# EAGLE design CHR_ver2 (EAGLE 9.6.2)

## Sheet 1 of 3
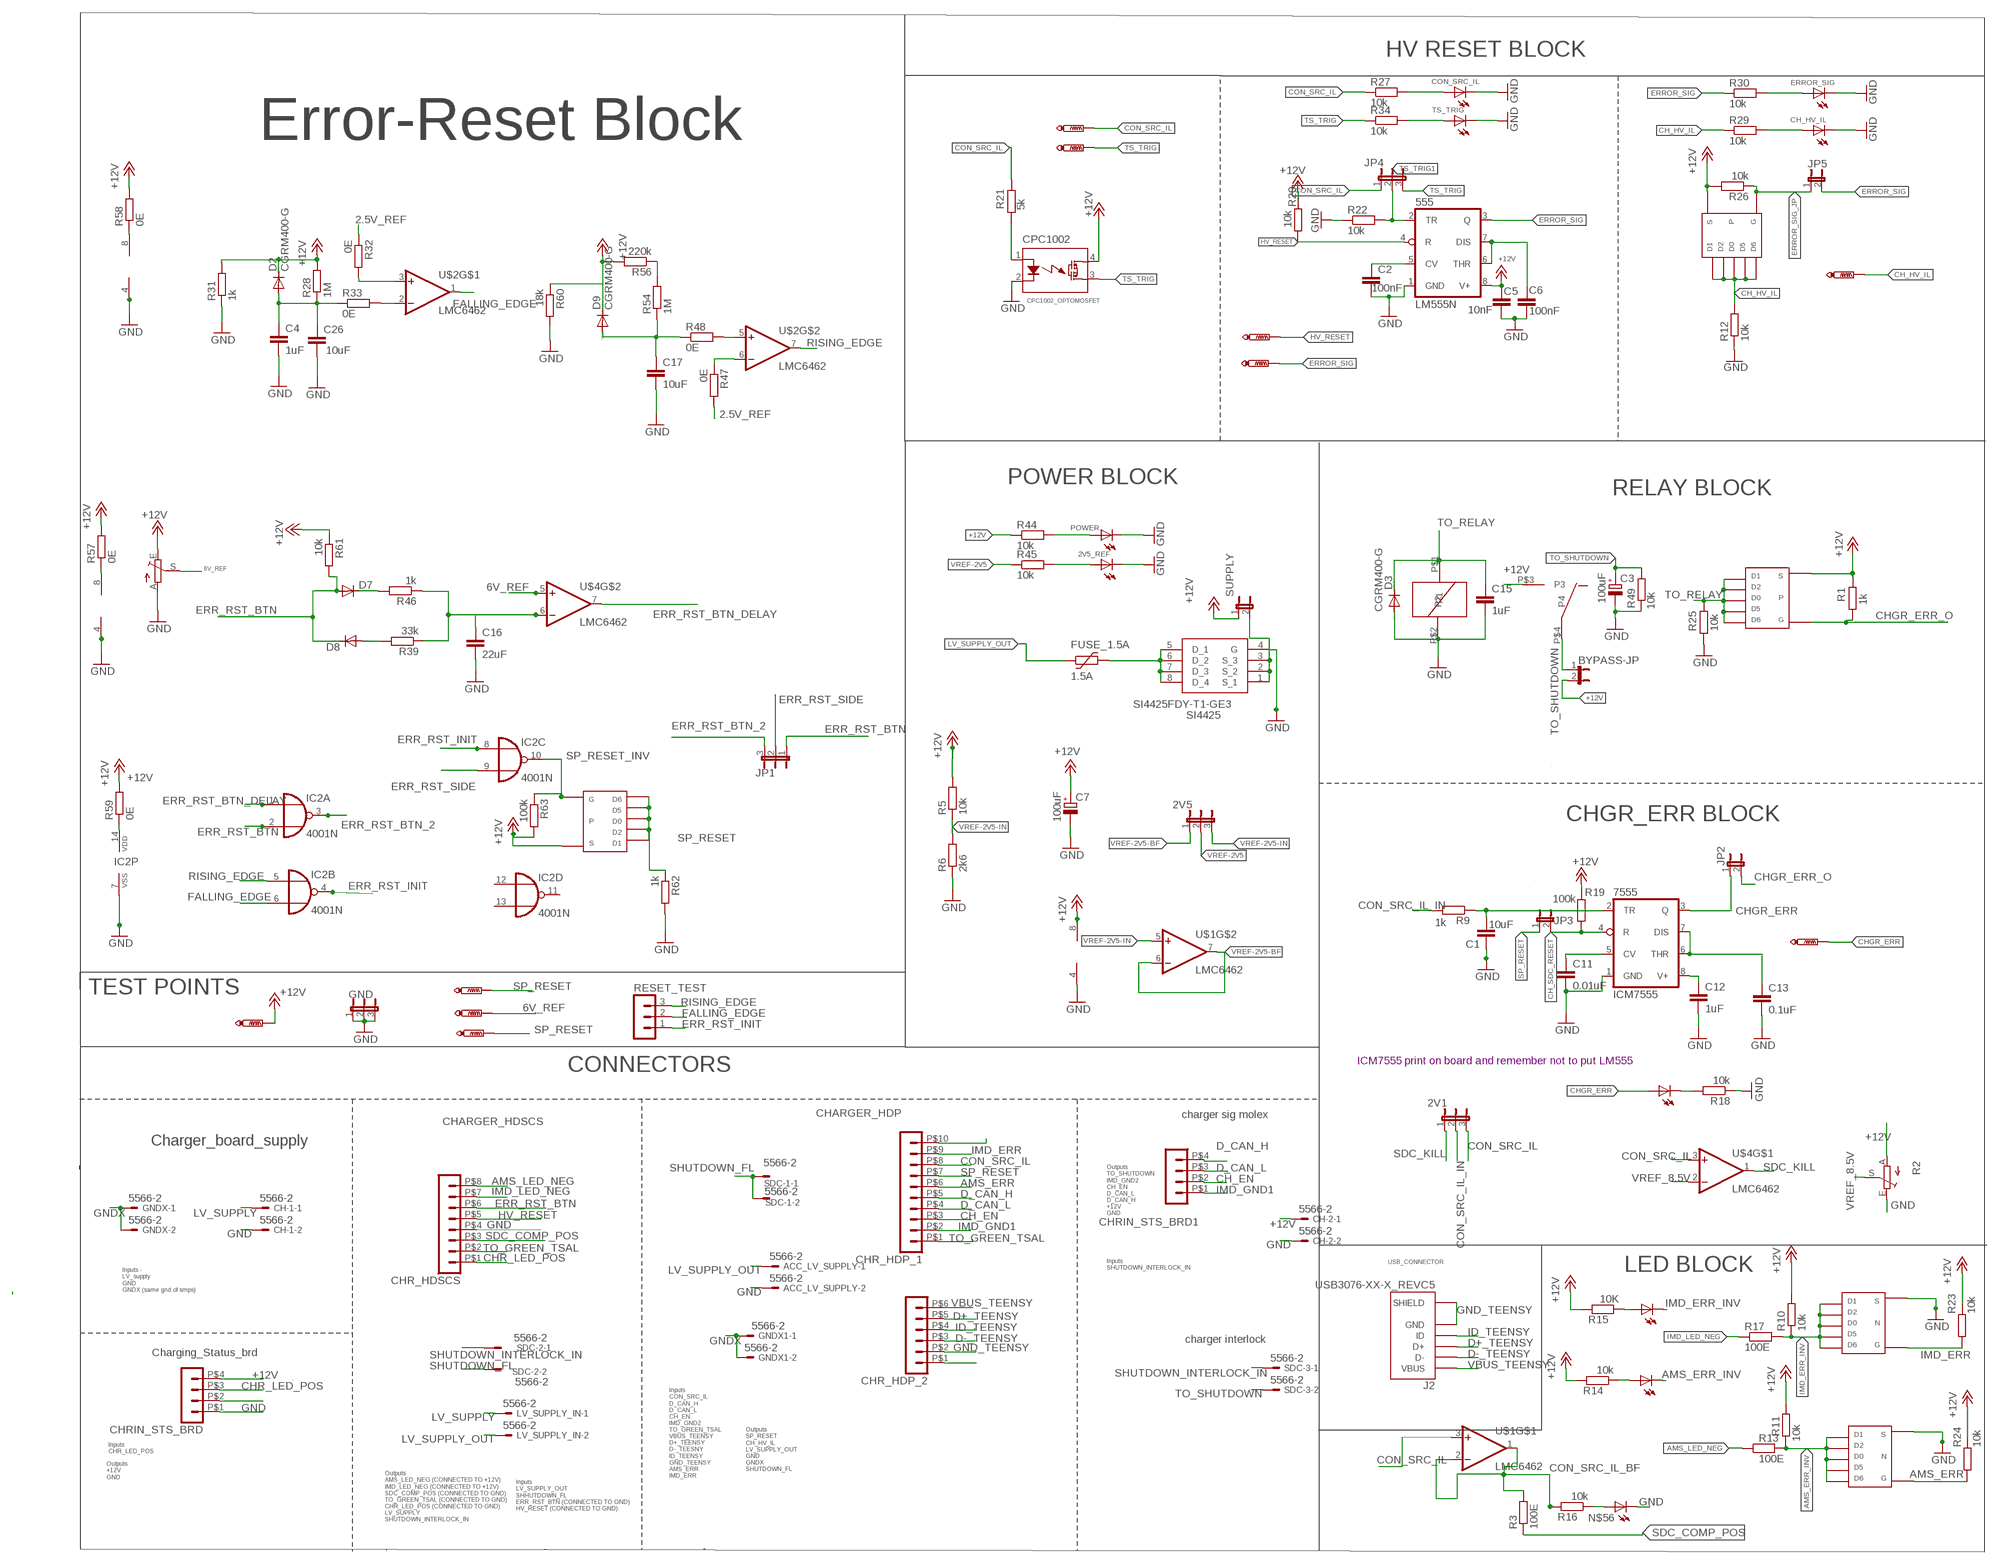
[diagram p0: schematic, sheet 1]

### Parts
2V1  JP2E  [JP2]
2V5  JP2E  [JP2]
2V5_REF  LED-FKIT-1206  [FKIT-LED-1206]
555  LM555N  [DIL08]
7555  ICM7555  LM555N  [DIL08]
+12V  PTR1PAD1-13  [P1-13]
ACC_LV_SUPPLY  5566-2  [5566-2]
AMS  LED-FKIT-1206  [FKIT-LED-1206]
AMS1  LED-FKIT-1206  [FKIT-LED-1206]
BYPASS-JP  JP1E  [JP1]
C1  10uF  C-EUC0805  [C0805]
C2  100nF  C-EUC0805  [C0805]
C3  100uF  CPOL-EUE2.5-6  [E2,5-6]
C4  1uF  C-EUC0805  [C0805]
C5  10nF  C-EUC0805  [C0805]
C6  100nF  C-EUC0805  [C0805]
C7  100uF  CPOL-EUE2.5-6  [E2,5-6]
C11  0.01uF  C-EUC0805  [C0805]
C12  1uF  C-EUC0805  [C0805]
C13  0.1uF  C-EUC0805  [C0805]
C15  1uF  C-EUC0805  [C0805]
C16  22uF  C-EUC0805  [C0805]
C17  10uF  C-EUC0805  [C0805]
C26  10uF  C-EUC0805  [C0805]
CH-1  5566-2  [5566-2]
CH-2  5566-2  [5566-2]
CH-HV-IL  PTR1PAD1-13  [P1-13]
CH_HV_IL  LED-FKIT-1206  [FKIT-LED-1206]
CHGR-ERR  PTR1PAD1-13  [P1-13]
CHGR_ERR  LED-FKIT-1206  [FKIT-LED-1206]
CHR_HDP_1  HEADER_POS10_44914-1001  [44914-1001]
CHR_HDP_2  HEADER_POS6_44914-0601  [44914-0601]
CHR_HDSCS  HEADER_POS8_44914-0801  [44914-0801]
CHRIN_STS_BRD  HEADER_POS4_44914-0401  [44914-0401]
CHRIN_STS_BRD1  HEADER_POS4_44914-0401  [44914-0401]
CON-SRC-IL  PTR1PAD1-13  [P1-13]
CON_SRC_IL  LED-FKIT-1206  [FKIT-LED-1206]
CPC1002  CPC1002_OPTOMOSFET  [SOP04]
D2  CGRM400-G  [SOD-123_MINI-SMA]
D3  CGRM400-G  [SOD-123_MINI-SMA]
D7  DIODE-DO214AC  [DO214AC]
D8  DIODE-DO214AC  [DO214AC]
D9  CGRM400-G  [SOD-123_MINI-SMA]
ERROR-SIG  PTR1PAD1-13  [P1-13]
ERROR_SIG  LED-FKIT-1206  [FKIT-LED-1206]
FUSE_1.5A  1.5A  1206L  [1206L]
GND  JP2E  [JP2]
GNDX  5566-2  [5566-2]
GNDX1  5566-2  [5566-2]
HV-RESET  PTR1PAD1-13  [P1-13]
IC2  4001N  [DIL14]
IMD  LED-FKIT-1206  [FKIT-LED-1206]
J2  USB3076-XX-X_REVC5  [GCT_USB3076-XX-X_REVC5]
JP1  JP2E  [JP2]
JP2  JP1E  [JP1]
JP3  JP1E  [JP1]
JP4  JP2E  [JP2]
JP5  JP1E  [JP1]
LV_SUPPLY_IN  5566-2  [5566-2]
POWER  LED-FKIT-1206  [FKIT-LED-1206]
R1  1k  R-EU_R0805  [R0805]
R2  TRIM_EU-S63S  [S63S]
R3  100E  R-EU_M0805  [M0805]
R5  10k  R-EU_R0805  [R0805]
R6  2k6  R-EU_R0805  [R0805]
R9  1k  R-EU_R0805  [R0805]
R10  10k  R-EU_R0805  [R0805]
R11  10k  R-EU_R0805  [R0805]
R12  10k  R-EU_R0805  [R0805]
R13  100E  R-EU_M0805  [M0805]
R14  10k  R-EU_M0805  [M0805]
R15  10K  R-EU_M0805  [M0805]
R16  10k  R-EU_M0805  [M0805]
R17  100E  R-EU_M0805  [M0805]
R18  10k  R-EU_R0805  [R0805]
R19  100k  R-EU_R0805  [R0805]
R20  10k  R-EU_R0805  [R0805]
R21  5k  R-EU_R0805  [R0805]
R22  10k  R-EU_R0805  [R0805]
R23  10k  R-EU_R0805  [R0805]
R24  10k  R-EU_R0805  [R0805]
R25  10k  R-EU_R0805  [R0805]
R26  10k  R-EU_R0805  [R0805]
R27  10k  R-EU_R0805  [R0805]
R28  1M  R-EU_R0805  [R0805]
R29  10k  R-EU_R0805  [R0805]
R30  10k  R-EU_R0805  [R0805]
R31  1k  R-EU_R0805  [R0805]
R32  0E  R-EU_R0805  [R0805]
R33  0E  R-EU_R0805  [R0805]
R34  10k  R-EU_R0805  [R0805]
R39  33k  R-EU_R0805  [R0805]
R44  10k  R-EU_R0805  [R0805]
R45  10k  R-EU_R0805  [R0805]
R46  1k  R-EU_R0805  [R0805]
R47  0E  R-EU_R0805  [R0805]
R48  0E  R-EU_R0805  [R0805]
R49  10k  R-EU_R0805  [R0805]
R54  1M  R-EU_R0805  [R0805]
R56  220k  R-EU_R0805  [R0805]
R57  0E  R-EU_R0805  [R0805]
R58  0E  R-EU_R0805  [R0805]
R59  0E  R-EU_R0805  [R0805]
R60  18k  R-EU_R0805  [R0805]
R61  10k  R-EU_R0805  [R0805]
R62  1k  R-EU_R0805  [R0805]
R63  100k  R-EU_R0805  [R0805]
REF_POT1  10k  TRIM_EU-S63S  [S63S]
RESET_TEST  MA03-1  [MA03-1]
SDC-1  5566-2  [5566-2]
SDC-2  5566-2  [5566-2]
SDC-3  5566-2  [5566-2]
SI4425  SI4425FDY-T1-GE3  [SOIC127P600X175-8N]
SP_RESET  PTR1PAD1-13  [P1-13]
SP_RESET1  PTR1PAD1-13  [P1-13]
SP_RESET2  PTR1PAD1-13  [P1-13]
SUPPLY  JP1E  [JP1]
TS-TRIG  PTR1PAD1-13  [P1-13]
TS_TRIG  LED-FKIT-1206  [FKIT-LED-1206]
U$1  LMC6462  [S08]
U$2  LMC6462  [S08]
U$3  TSOP-6_PMOS  [TSOP-6_PMOS]
U$4  LMC6462  [S08]
U$5  TSOP-6_NMOS  [TSOP-6_NMOS]
U$7  TSOP-6_NMOS  [TSOP-6_NMOS]
U$8  TSOP-6_PMOS  [TSOP-6_PMOS]
U$9  G6DN_RELAY  [G6DN_RELAY]
U$11  TSOP-6_PMOS  [TSOP-6_PMOS]

### Nets
2.5V_REF: R32.1 R47.2
6V_REF: REF_POT1.S SP_RESET1.TP U$4.5(+IN)
+12V: 555.8(V+) 7555.8(V+) +12V.TP BYPASS-JP.2 C5.1 C7.+ C12.1 CH-2.1 CHRIN_STS_BRD.P$4 CPC1002.4 D2.C D9.C R1.2 R2.A R5.2 R10.2 R11.2 R14.2 R15.2 R19.1 R20.2 R23.2 R24.2 R26.2 R28.2 R31.2 R44.1 R56.2 R57.2 R58.2 R59.2 R60.1 R61.1 R63.2 REF_POT1.E SUPPLY.1 U$1.8(V+) U$3.S U$8.S U$9.P$3(P3) U$11.S
AMS_ERR: CHR_HDP_1.P$6 R24.1 U$5.G
AMS_ERR_INV: AMS.C R11.1 R13.2 U$5.1 U$5.2 U$5.5 U$5.6 U$5.D(D0)
AMS_LED_NEG: CHR_HDSCS.P$8 R13.1
CH_EN: CHR_HDP_1.P$3 CHRIN_STS_BRD1.P$2
CH_HV_IL: CH-HV-IL.TP CHR_HDP_1.P$10 R12.2 R29.1 U$8.1 U$8.2 U$8.5 U$8.6 U$8.D(D0)
CH_SDC_RESET: 7555.4(R) JP3.2 R19.2
CHGR_ERR: 7555.3(Q) CHGR-ERR.TP CHGR_ERR.A JP2.1
CHGR_ERR_O: JP2.2 R1.1 U$3.G
CHR_LED_POS: CHR_HDSCS.P$1 CHRIN_STS_BRD.P$3
CON_SRC_IL: 2V1.3 CHR_HDP_1.P$8 CON-SRC-IL.TP JP4.1 R21.2 R27.1 U$1.3(+IN) U$4.3(+IN)
CON_SRC_IL_BF: R3.2 R16.2 U$1.1(OUT) U$1.2(-IN)
CON_SRC_IL_IN: 2V1.2 R9.2
D+_TEENSY: CHR_HDP_2.P$5 J2.3(D+)
D-_TEENSY: CHR_HDP_2.P$3 J2.2(D-)
D_CAN_H: CHR_HDP_1.P$5 CHRIN_STS_BRD1.P$4
D_CAN_L: CHR_HDP_1.P$4 CHRIN_STS_BRD1.P$3
ERR_RST_BTN: CHR_HDSCS.P$6 D7.A D8.C IC2.2(A:I1) JP1.1 R61.2
ERR_RST_BTN_2: IC2.3(A:O) JP1.3
ERR_RST_BTN_DELAY: IC2.1(A:I0) U$4.7(OUT)
ERR_RST_INIT: IC2.4(B:O) IC2.8(C:I0) RESET_TEST.1
ERR_RST_SIDE: IC2.9(C:I1) JP1.2
ERROR_SIG: 555.3(Q) ERROR-SIG.TP JP5.2 R30.1
ERROR_SIG_JP: JP5.1 R26.1 U$8.G
FALLING_EDGE: IC2.6(B:I1) RESET_TEST.2 U$2.1(OUT)
GND: 2V5_REF.C 555.1(GND) 7555.1(GND) ACC_LV_SUPPLY.2 AMS1.C C1.1 C2.2 C3.- C4.2 C5.2 C6.2 C7.- C11.2 C12.2 C13.2 C15.2 C16.2 C17.2 C26.2 CH-1.2 CH-2.2 CH_HV_IL.C CHR_HDSCS.P$4 CHRIN_STS_BRD.P$1 CON_SRC_IL.C CPC1002.2 D3.A ERROR_SIG.C GND.1 GND.2 GND.3 IC2.7(P:VSS) POWER.C R2.E R6.1 R12.1 R18.1 R22.1 R25.1 R31.1 R49.1 R60.2 R62.2 REF_POT1.A SI4425.4(G) TS_TRIG.C U$1.4(V-) U$2.4(V-) U$4.4(V-) U$5.S U$7.S U$9.P$2(P2)
GND_TEENSY: CHR_HDP_2.P$2 J2.5(GND) J2.6(SHIELD) J2.7(SHIELD) J2.8(SHIELD) J2.9(SHIELD) J2.10(SHIELD) J2.11(SHIELD)
GNDX: GNDX1.1 GNDX1.2 GNDX.1 GNDX.2
HV_RESET: 555.4(R) CHR_HDSCS.P$5 HV-RESET.TP R20.1
ID_TEENSY: CHR_HDP_2.P$4 J2.4(ID)
IMD_ERR: CHR_HDP_1.P$9 R23.1 U$7.G
IMD_ERR_INV: IMD.C R10.1 R17.2 U$7.1 U$7.2 U$7.5 U$7.6 U$7.D(D0)
IMD_GND1: CHR_HDP_1.P$2 CHRIN_STS_BRD1.P$1
IMD_LED_NEG: CHR_HDSCS.P$7 R17.1
LV_SUPPLY: CH-1.1 LV_SUPPLY_IN.1
LV_SUPPLY_OUT: ACC_LV_SUPPLY.1 FUSE_1.5A.P$1 LV_SUPPLY_IN.2
N$1: 7555.2(TR) C1.2 R9.1
N$3: 555.5(CV) C2.1
N$4: CHGR_ERR.C R18.2
N$7: 555.6(THR) 555.7(DIS) C6.1
N$9: CPC1002.1 R21.1
N$10: CON_SRC_IL.A R27.2
N$11: CH_HV_IL.A R29.2
N$13: ERROR_SIG.A R30.2
N$14: R34.2 TS_TRIG.A
N$16: 7555.5(CV) C11.1
N$18: 7555.6(THR) 7555.7(DIS) C13.1
N$21: SI4425.1(S_1) SI4425.2(S_2) SI4425.3(S_3) SUPPLY.2
N$23: FUSE_1.5A.P$2 SI4425.5(D_1) SI4425.6(D_2) SI4425.7(D_3) SI4425.8(D_4)
N$24: POWER.A R44.2
N$26: 2V5_REF.A R45.2
N$33: CHR_HDP_2.P$1
N$35: AMS.A R14.1
N$37: IMD.A R15.1
N$38: C4.1 C26.1 D2.A R28.1 R33.1
N$39: CHRIN_STS_BRD.P$2
N$40: R32.2 U$2.3(+IN)
N$41: R33.2 U$2.2(-IN)
N$42: D8.A R39.2
N$43: D7.C R46.2
N$44: C16.1 R39.1 R46.1 U$4.6(-IN)
N$45: R47.1 U$2.6(-IN)
N$46: C17.1 D9.A R48.1 R54.1
N$47: R48.2 U$2.5(+IN)
N$48: R54.2 R56.1
N$49: R58.1 U$2.8(V+)
N$50: R57.1 U$4.8(V+)
N$51: IC2.14(P:VDD) R59.1
N$56: AMS1.A R16.1
RISING_EDGE: IC2.5(B:I0) RESET_TEST.3 U$2.7(OUT)
SDC_COMP_POS: CHR_HDSCS.P$3 R3.1
SDC_KILL: 2V1.1 U$4.1(OUT)
SHUTDOWN_FL: SDC-1.1 SDC-1.2 SDC-2.2
SHUTDOWN_INTERLOCK_IN: SDC-2.1 SDC-3.1
SP_RESET: CHR_HDP_1.P$7 JP3.1 R62.1 SP_RESET2.TP SP_RESET.TP U$11.1 U$11.2 U$11.5 U$11.6 U$11.D(D0)
SP_RESET_INV: IC2.10(C:O) R63.1 U$11.G
TO_GREEN_TSAL: CHR_HDP_1.P$1 CHR_HDSCS.P$2
TO_RELAY: C15.1 D3.C R25.2 U$3.1 U$3.2 U$3.5 U$3.6 U$3.D(D0) U$9.P$1(P1)
TO_SHUTDOWN: BYPASS-JP.1 C3.+ R49.2 SDC-3.2 U$9.P$4(P4)
TS_TRIG: CPC1002.3 JP4.3 R34.1 TS-TRIG.TP
TS_TRIG1: 555.2(TR) JP4.2 R22.2
VBUS_TEENSY: CHR_HDP_2.P$6 J2.1(VBUS)
VREF-2V5: 2V5.2 R45.1
VREF-2V5-BF: 2V5.1 U$1.6(-IN) U$1.7(OUT)
VREF-2V5-IN: 2V5.3 R5.1 R6.2 U$1.5(+IN)
VREF_8.5V: R2.S U$4.2(-IN)
Unconnected: IC2.11(D:O) IC2.12(D:I0) IC2.13(D:I1)

### Notes on the sheet
- HV RESET BLOCK
- Error-Reset Block
- POWER BLOCK
- RELAY BLOCK
- CHGR_ERR BLOCK
- TEST POINTS
- ICM7555 print on board and remember not to put LM555
- CONNECTORS
- CHARGER_HDP | charger sig molex
- CHARGER_HDSCS
- Charger_board_supply
- Outputs
  TO_SHUTDOWN
  IMD_GND2
  CH_EN
  D_CAN_L
  D_CAN_H
  +12V
  GND
- USB_CONNECTOR
- Inputs
  SHUTDOWN_INTERLOCK_IN
- LED BLOCK
- Inputs -
  LV_supply
  GND
  GNDX (same gnd of smps)
- charger interlock
- Charging_Status_brd
- Inputs
  CHR_LED_POS
- Inputs
  CON_SRC_IL
  D_CAN_H
  D_CAN_L
  CH_EN
  IMD_GND2
  TO_GREEN_TSAL
  VBUS_TEENSY
  D+_TEENSY
  D-_TEESNY
  ID_TEENSY
  GND_TEENSY
  AMS_ERR
  IMD_ERR
- Outputs
  SP_RESET
  CH_HV_IL
  LV_SUPPLY_OUT
  GND
  GNDX
  SHUTDOWN_FL
- Outputs
  +12V
  GND
- Inputs
  LV_SUPPLY_OUT
  SHHUTDOWN_FL
  ERR_RST_BTN (CONNECTED TO GND)
  HV_RESET (CONNECTED TO GND)
- Outputs
  AMS_LED_NEG (CONNECTED TO +12V)
  IMD_LED_NEG (CONNECTED TO +12V)
  SDC_COMP_POS (CONNECTED TO GND)
  TO_GREEN_TSAL (CONNECTED TO GND)
  CHR_LED_POS (CONNECTED TO GND)
  LV_SUPPLY
  SHUTDOWN_INTERLOCK_IN

## Sheet 2 of 3

## Sheet 3 of 3

## Library data of the parts
2V1 2V5 GND JP1 JP4 = jumper:JP2E: JUMPER
2V5_REF AMS AMS1 CH_HV_IL CHGR_ERR CON_SRC_IL ERROR_SIG IMD POWER TS_TRIG = IIT_BOMBAY_Racing:LED: LEDs Standard schematic elements and footprints for 5mm, 3mm, 1206, and 0603 sized LEDs. 5mm - Spark Fun Electronics SKU : COM-00529 (and others)
555 7555 = linear:*555: TIMER
+12V CH-HV-IL CHGR-ERR CON-SRC-IL ERROR-SIG HV-RESET SP_RESET SP_RESET1 SP_RESET2 TS-TRIG = testpad:PTR1: TEST PIN
ACC_LV_SUPPLY CH-1 CH-2 GNDX GNDX1 LV_SUPPLY_IN SDC-1-SDC-3 = con-molex:5566-2: Mini FIT connector 2 pol Source: http://www.molex.com; MF: MOLEX; OC_FARNELL: 1822072; OC_NEWARK: unknown
BYPASS-JP JP2 JP3 JP5 SUPPLY = jumper:JP1E: JUMPER
C1 C2 C4-C6 C11-C13 C15-C17 C26 = IIT_BOMBAY_Racing:C-EU: CAPACITOR, European symbol
C3 C7 = IIT_BOMBAY_Racing:CPOL-EU: POLARIZED CAPACITOR, European symbol
CHR_HDP_1 = IIT_BOMBAY_Racing:HEADER_POS10_?: Molex - Micro-Fit 3.0 Series connector, 3.00mm (0.118") pitch header, 10 positions.
CHR_HDP_2 = IIT_BOMBAY_Racing:HEADER_POS6_?: Molex - Micro-Fit 3.0 Series connector, 3.00mm (0.118") pitch header, 6 positions.
CHR_HDSCS = IIT_BOMBAY_Racing:HEADER_POS8_?: Molex - Micro-Fit 3.0 Series connector, 3.00mm (0.118") pitch header, 8 positions.
CHRIN_STS_BRD CHRIN_STS_BRD1 = IIT_BOMBAY_Racing:HEADER_POS4_?: Molex - Micro-Fit 3.0 Series connector, 3.00mm (0.118") pitch header, 4 positions.
CPC1002 = IIT_BOMBAY_Racing:CPC1002_OPTOMOSFET: optomosfet for the precharge brd(hv indicator)
D2 D3 D9 = IIT_BOMBAY_Racing:CGRM400*-G: Molded plasitc,JEDEC SOD-123/Mini SMA Source: Comchip CGRM4001-G.pdf
D7 D8 = IIT_BOMBAY_Racing2:DIODE-: DIODE
FUSE_1.5A = fuse_1206L:1206L; MFR: Littelfuse; MFR_ID: 1206L175SLYR; PRODUCT_ID: 576-1206L175SLYR
IC2 = 40xx:4001: Quad 2-input NOR
J2 = USB3076-XX-X_REVC5:USB3076-XX-X_REVC5: Check availability <https://pricing.snapeda.com/parts/USB3076-30-A/Global%20Connector%20Technology/view-part?ref=eda>; AVAILABILITY: Not in stock; CHECK_PRICES: https://www.snapeda.com/parts/USB3076-30-A/Global+Connector+Technology/view-part/?ref=eda; DESCRIPTION: USB - micro B USB 2.0 Receptacle Connector 5 Position Surface Mount, Right Angle; Through Hole, 2.35mm profile, 5 Pins, Horizontal, Bottom mount; MF: Global Connector Technology; MP: USB3076-30-A; PACKAGE: None; PRICE: None; SNAPEDA_LINK: https://www.snapeda.com/parts/USB3076-30-A/Global+Connector+Technology/view-part/?ref=snap
R1 R5 R6 R9-R12 R18-R34 R39 R44-R49 R54 R56-R63 = IIT_BOMBAY_Racing:R-EU_: RESISTOR, European symbol
R2 REF_POT1 = IIT_BOMBAY_Racing:TRIM_EU-: POTENTIOMETER
R3 R13-R17 = rcl:R-EU_: RESISTOR, European symbol; SPICEPREFIX: R
RESET_TEST = con-lstb:MA03-1: PIN HEADER; OC_FARNELL: unknown; OC_NEWARK: unknown
SI4425 = SamacSys_Parts:SI4425FDY-T1-GE3: MOSFET P-CHANNEL 30-V (D-S) MOSFET Source: Datasheet <https://www.vishay.com/docs/77095/si4425fdy.pdf>; DESCRIPTION: MOSFET P-CHANNEL 30-V (D-S) MOSFET; HEIGHT: 1.75mm; MANUFACTURER_NAME: Vishay; MANUFACTURER_PART_NUMBER: SI4425FDY-T1-GE3; MOUSER_PART_NUMBER: 78-SI4425FDY-T1-GE3; MOUSER_PRICE-STOCK: https://www.mouser.co.uk/ProductDetail/Vishay-Siliconix/SI4425FDY-T1-GE3?qs=%252B6g0mu59x7IUQKSn86z1oQ%3D%3D
U$1 U$2 U$4 = IIT_BOMBAY_Racing:LMC6462
U$3 U$11 = TSOP-6_MOS:TSOP-6_PMOS
U$5 U$7 = TSOP-6_MOS:TSOP-6_NMOS
U$8 = ACU-MOSFET-updated:TSOP-6_PMOS
U$9 = G6DN_Omron:G6DN_RELAY

## Board
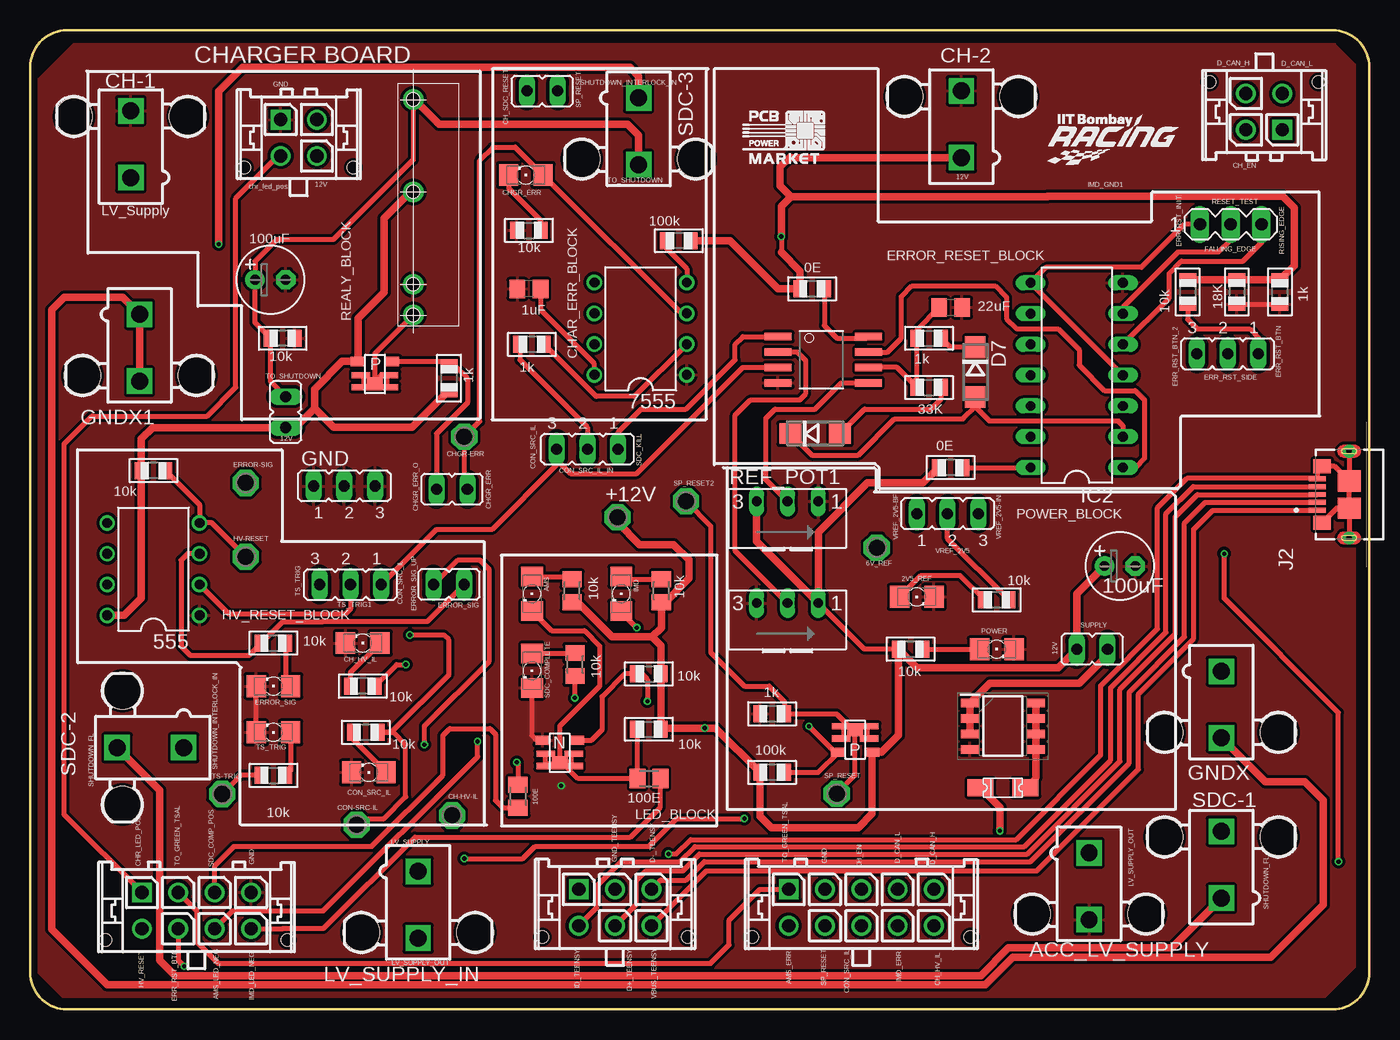
[diagram p1: board, top side]
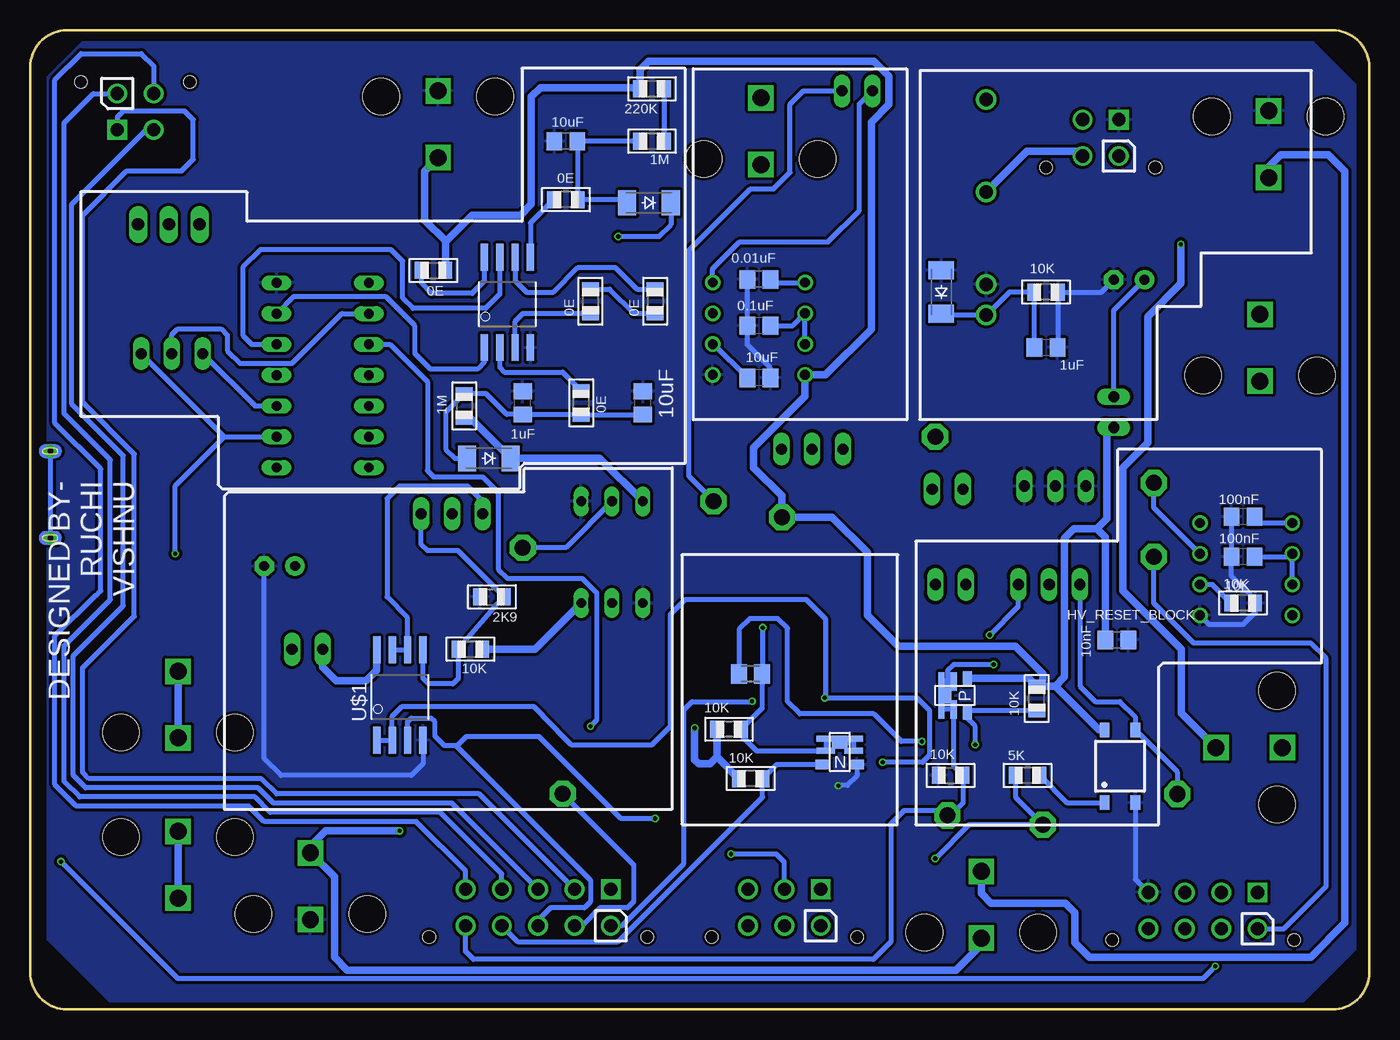
[diagram p2: board, bottom side, seen from below]

Size 110.49 x 80.77 mm. Coordinates in mm from the lower left corner, seen from the top.
Outline: 0,3.05 0,77.72 arc-90 3.05,80.77 107.44,80.77 arc-90 110.49,77.72 110.49,3.05 arc-90 107.44,0 3.05,0 arc-90 0,3.05
Copper layers (1*16): Top 0.035mm / dielectric 1.5mm / Bottom 0.035mm
Design rules "PCB_Power": minimum track width 5mil, minimum drill 10mil, track to track 5mil, track to pad 5mil, pad to pad 5mil, via to via 5mil, smd to smd 5mil, copper to edge 10mil, drill to drill 6mil, minimum pad ring 5mil, minimum via ring 5mil, stop-mask expansion 3mil, vias tented up to drill 0mil, thermal gap 10mil

### Footprints (pad centres in the part's own frame; a part is rotated, then mirrored left to right if it is on the bottom)
JP2 = drill 0.914 long: 1 -2.54,0; 2 0,0; 3 2.54,0
FKIT-LED-1206 = smd 1.6 x 1.803: A -1.422,0; C 1.422,0
DIL08 = drill 0.813 pad 1.27: 1 -3.81,-3.81; 2 -1.27,-3.81; 3 1.27,-3.81; 4 3.81,-3.81; 5 3.81,3.81; 6 1.27,3.81; 7 -1.27,3.81; 8 -3.81,3.81
P1-13 = drill 1.321 pad 2.159 octagon: TP 0,0
5566-2 = drill 1.4 square: 1 0,-2.75; 2 0,2.75 | hole 3: 4.7,2.29; -4.7,2.29
JP1 = drill 0.914 long: 1 0,-1.27; 2 0,1.27
C0805 = smd 1.3 x 1.5: 1 -0.95,0; 2 0.95,0
E2,5-6 = drill 0.813 pad 1.6: + -1.27,0 | drill 0.813 pad 1.6 octagon: - 1.27,0
44914-1001 = drill 1.09 square: P$1 6,0 | drill 1.09: P$2 3,0; P$3 0,0; P$4 -3,0; P$5 -6,0; P$6 6,3; P$7 3,3; P$8 0,3; P$9 -3,3; P$10 -6,3 | hole 1.02: 9,3.94; -9,3.94
44914-0601 = drill 1.09 square: P$1 3,0 | drill 1.09: P$2 0,0; P$3 -3,0; P$4 3,3; P$5 0,3; P$6 -3,3 | hole 1.02: 6,3.94; -6,3.94
44914-0801 = drill 1.09 square: P$1 4.5,0 | drill 1.09: P$2 1.5,0; P$3 -1.5,0; P$4 -4.5,0; P$5 4.5,3; P$6 1.5,3; P$7 -1.5,3; P$8 -4.5,3 | hole 1.02: 7.5,3.94; -7.5,3.94
44914-0401 = drill 1.09 square: P$1 1.5,0 | drill 1.09: P$2 -1.5,0; P$3 1.5,3; P$4 -1.5,3 | hole 1.02: 4.5,3.94; -4.5,3.94
SOP04 = smd 0.8 x 1.2: 1 -1.27,-3; 2 1.27,-3; 3 1.27,3; 4 -1.27,3
SOD-123_MINI-SMA = smd 1.5 x 2.1: A 1.8,0; C -1.8,0
DO214AC = smd 1.8 x 1.7: A 2.05,0; C -2.05,0
1206L = smd 2.16 x 1.4: P$1 -1.85,0; P$2 1.85,0
DIL14 = drill 0.813 long: 1 -7.62,-3.81; 2 -5.08,-3.81; 3 -2.54,-3.81; 4 0,-3.81; 5 2.54,-3.81; 6 5.08,-3.81; 7 7.62,-3.81; 8 7.62,3.81; 9 5.08,3.81; 10 2.54,3.81; 11 0,3.81; 12 -2.54,3.81; 13 -5.08,3.81; 14 -7.62,3.81
GCT_USB3076-XX-X_REVC5 = smd 0.4 x 1.4: 1 -1.3,2.65; 2 -0.65,2.65; 3 0,2.65; 4 0.65,2.65; 5 1.3,2.65 | drill 0.45 pad 1.05: 6 -3.575,0; 7 3.575,0 | smd 1.15 x 1.45: 8 -2.32,2.23; 9 2.32,2.23 | smd 1.75 x 1.9: 10 -1.125,0; 11 1.125,0
R0805 = smd 1.1 x 1.4: 1 -1,0; 2 1,0
S63S = drill 0.813 long: A 2.54,1.27; E -2.54,1.27; S 0,1.27
M0805 = smd 1.3 x 1.6: 1 -0.95,0; 2 0.95,0
MA03-1 = drill 1.016 long: 1 -2.54,0; 2 0,0; 3 2.54,0
SOIC127P600X175-8N = smd 1.525 x 0.7: 1 -2.712,1.905; 2 -2.712,0.635; 3 -2.712,-0.635; 4 -2.712,-1.905; 5 2.712,-1.905; 6 2.712,-0.635; 7 2.712,0.635; 8 2.712,1.905
S08 = smd 0.61 x 2.21: 1 -1.905,-3.569; 2 -0.635,-3.569; 3 0.635,-3.569; 4 1.905,-3.569; 5 1.905,3.886; 6 0.635,3.886; 7 -0.635,3.886; 8 -1.905,3.886
TSOP-6_PMOS = smd 0.5 x 1.92: 1 -1,-0.96; 6 -1,0.96 | smd 0.5 x 1.52: 2 0,-1.16; 5 0,1.16 | smd 0.635 x 1.27: D -0.5,0 | smd 0.75 x 1.2: G 1.13,-1.4; S 1.13,1.4
TSOP-6_NMOS = smd 0.5 x 1.92: 1 -1,-0.96; 6 -1,0.96 | smd 0.5 x 1.52: 2 0,-1.16; 5 0,1.16 | smd 0.635 x 1.27: D -0.5,0 | smd 0.75 x 1.2: G 1.13,-1.4; S 1.13,1.4
G6DN_RELAY = drill 1.118 pad 1.575: P$1 0.889,3.708; P$2 3.429,3.708; P$3 11.049,3.708; P$4 18.669,3.708

### Placement (x,y rotation side)
2V1  45.97,46.23 180 top
2V5  75.69,40.89 0 top
2V5_REF  73.15,34.04 0 top
555  10.16,36.32 90 top
7555  50.37,56.15 90 top
+12V  48.47,40.61 0 top
ACC_LV_SUPPLY  87.38,10.16 180 top
AMS  41.4,34.29 270 top
AMS1  41.4,27.94 270 top
BYPASS-JP  21.08,49.28 180 top
C1  50.37,52.09 180 bottom
C2  10.41,40.64 180 bottom
C3  19.81,60.2 0 top
C4  69.85,50.04 90 bottom
C5  20.83,30.48 0 bottom
C6  10.41,37.34 180 bottom
C7  89.92,36.58 0 top
C11  50.37,60.22 180 bottom
C12  41.15,59.44 180 top
C13  50.37,56.41 180 bottom
C15  26.67,54.61 0 bottom
C16  75.95,57.91 0 top
C17  66.29,71.63 180 bottom
C26  59.94,50.04 90 bottom
CH-1  8.29,71.37 0 top
CH-2  76.84,73.02 0 top
CH-HV-IL  34.8,16 0 top
CH_HV_IL  27.43,30.23 180 top
CHGR-ERR  35.81,47.24 0 top
CHGR_ERR  40.89,68.83 180 top
CHR_HDP_1  68.58,9.91 180 top
CHR_HDP_2  48.26,9.91 180 top
CHR_HDSCS  13.72,9.65 180 top
CHRIN_STS_BRD  22.15,73.41 180 top
CHRIN_STS_BRD1  101.82,72.56 0 top
CON-SRC-IL  26.92,15.24 0 top
CON_SRC_IL  27.94,19.56 180 top
CPC1002  20.57,20.07 0 bottom
D2  72.64,45.47 180 bottom
D3  35.31,59.18 90 bottom
D7  77.98,52.58 270 top
D8  64.77,47.5 0 top
D9  59.44,66.55 180 bottom
ERROR-SIG  17.78,43.43 0 top
ERROR_SIG  20.07,26.67 180 top
FUSE_1.5A  80.26,18.29 0 top
GND  25.91,43.18 0 top
GNDX  98.3,25.15 180 top
GNDX1  9.01,54.59 180 top
HV-RESET  17.78,37.34 0 top
IC2  86.36,52.32 90 top
IMD  48.77,34.29 270 top
J2  108.84,42.48 90 top
JP1  98.81,54.1 180 top
JP2  34.8,42.93 90 top
JP3  42.25,75.77 90 top
JP4  26.42,35.05 180 top
JP5  34.54,35.05 270 top
LV_SUPPLY_IN  32,8.64 180 top
POWER  79.76,29.72 0 top
R1  34.54,52.07 270 top
R2  62.48,32.26 0 top
R3  40.24,17.59 90 top
R5  74.17,29.72 0 bottom
R6  72.39,34.04 0 bottom
R9  41.4,54.86 180 top
R10  52.83,23.11 180 bottom
R11  51.05,23.11 0 top
R12  34.54,19.3 0 bottom
R13  51.05,19.05 180 top
R14  44.7,34.54 270 top
R15  52.07,34.54 270 top
R16  44.96,28.45 270 top
R17  51.05,27.69 0 bottom
R18  41.15,64.26 0 top
R19  53.52,63.41 180 top
R20  10.16,44.45 180 top
R21  28.19,19.3 180 bottom
R22  10.41,33.53 180 bottom
R23  51.05,19.05 180 bottom
R24  51.05,27.69 0 top
R25  26.67,59.18 180 bottom
R26  27.43,25.65 90 bottom
R27  27.69,22.86 180 top
R28  74.68,49.78 270 bottom
R29  27.43,26.67 180 top
R30  20.07,30.23 0 top
R31  103.12,59.18 90 top
R32  64.26,58.42 270 bottom
R33  65.02,50.04 90 bottom
R34  20.07,19.3 0 top
R39  74.17,51.31 0 top
R44  72.64,29.72 0 top
R45  79.76,33.78 180 top
R46  74.17,55.37 0 top
R47  58.93,58.42 270 bottom
R48  66.29,66.8 180 bottom
R49  20.83,55.37 180 top
R54  59.18,71.63 0 bottom
R56  59.18,75.95 180 bottom
R57  64.52,59.44 180 top
R58  77.22,60.96 0 bottom
R59  75.95,44.7 180 top
R60  99.57,59.18 270 top
R61  95.5,59.18 270 top
R62  61.21,24.38 180 top
R63  61.21,19.56 180 top
REF_POT1  62.48,40.64 0 top
RESET_TEST  99.06,64.77 0 top
SDC-1  98.3,11.94 0 top
SDC-2  9.91,21.59 90 top
SDC-3  50.21,72.44 180 top
SI4425  80.26,23.37 0 top
SP_RESET  66.55,17.78 0 top
SP_RESET1  69.85,38.1 0 top
SP_RESET2  54.1,41.91 0 top
SUPPLY  87.63,29.72 270 top
TS-TRIG  15.83,17.77 0 top
TS_TRIG  20.07,22.86 180 top
U$1  79.99,25.78 0 bottom
U$2  71.12,58.17 0 bottom
U$3  28.45,52.32 90 top
U$4  65.28,53.59 270 top
U$5  43.69,21.08 90 top
U$7  43.69,21.34 270 bottom
U$8  34.29,25.91 0 bottom
U$9  35.31,56.39 90 top
U$11  68.07,22.35 270 top
U$13  LOGO_PCBPOWER  [270X170]  58.75,69.75 0 top
U$15  [IITBR_LOGO]  83.93,69.61 0 top

### Tracks (layer width: path | path; a pad name or v marks a point on that pad's centre or on a via)
2.5V_REF
  Bottom 0.406: R32.1 62.68,59.42 60.68,57.42 R47.2
6V_REF
  Top 0.406: REF_POT1.S 60.71,43.69 60.71,48.77 61.47,49.53 64.77,49.53 66.93,51.69 U$4.5
  Bottom 0.406: REF_POT1.S 66.29,38.1 SP_RESET1.TP
+12V  (via drill 0.35)
  Top 0.406: R14.2 45.15,33.59 | 52.07,33.27 R15.2 | 51.31,30.73 51.31,30.74 | 7555.8 46.56,53.25 42.1,57.71 C12.1 | 21.11,48.04 BYPASS-JP.2 | 31.37,67.44 U$9.P$3 | U$11.S 70.24,21.22 | R44.1 68.83,29.72 R2.A | v61.98,63.75 61.98,62.45 | 83.94,67.06 83.94,67.08 | R11.2 52.15,23.21
  Top 0.61: 45.15,33.59 48.01,30.73 51.31,30.73 | R11.2 R24.2 52.05,30 51.31,30.74 52.07,31.5 52.07,33.27 54.36,35.56 54.36,37.08 53.09,38.35 50.29,38.35 48.47,40.18 +12V.TP | R61.1 R60.1 R31.2 104.29,61.35 104.29,66.15 103.36,67.08 83.94,67.08 | R1.2 31.51,48.03 25.01,48.03 23.45,49.59 | 31.37,67.44 29.21,65.28 29.21,59.18 27.05,57.02 U$3.S 25.73,53.45 23.45,51.18 23.45,49.59 | 555.8 7.76,32.51 9.16,33.91 R20.2 9.16,47.07 10.09,48.01 BYPASS-JP.2 | REF_POT1.E 59.94,38.61 R2.A 65.02,39.37 69.09,43.43 73.68,43.43 R59.2 | R19.1 57.74,63.41 61.72,59.44 R57.2 63.52,60.91 61.98,62.45 | 70.24,21.22 71.64,22.62 R44.1 73.17,28.19 84.84,28.19 SUPPLY.1 86.36,34.29 C7.+ | v61.98,63.75 61.98,66.27 62.76,67.06 | 62.76,67.06 83.94,67.06 | 52.15,23.21 v55.66,23.21 56.56,23.21 R63.2 60.21,15.92 61.15,14.99 68.33,14.99 69.47,16.13 U$11.S | CH-2.1 62.63,70.27 61.87,69.51 61.87,67.95 62.76,67.06 | 23.45,49.59 21.9,48.04 21.11,48.04
  Bottom 0.305: 76.22,63.34 76.19,63.36
  Bottom 0.406: CPC1002.4 22.3,23.07 | 27.42,26.67 R26.2 | 55.47,78.24 55.41,78.18 55.35,78.23 | 60.18,76.05 R56.2 | D9.C 57.64,64.75 58.63,63.75 v61.98,63.75 | 74.16,48.78 R28.2
  Bottom 0.61: U$8.S 28.09,27.31 R26.2 26.92,27.16 26.92,27.69 29.21,29.97 38.86,29.97 41.42,32.53 41.42,37.71 44.32,40.61 +12V.TP 48.47,42.37 50.8,44.7 50.8,46.32 46.56,50.57 7555.8 44.88,52.34 41.1,56.13 41.1,73.2 39.62,74.68 39.62,77 40.86,78.23 55.35,78.23 | 22.3,23.07 25.91,26.67 | 27.42,26.67 25.91,26.67 | 55.47,78.24 59.46,78.24 60.18,77.52 60.18,76.05 68.38,76.05 69.15,75.29 69.15,66.43 70.05,65.53 74.03,65.53 76.19,63.36 77.94,65.12 77.94,69.17 CH-2.1 | REF_POT1.E 63.5,45.47 D2.C 74.16,48.78 | R10.2 53.83,20.83 | 53.83,20.83 R23.2 | 25.91,26.67 25.15,27.43 25.15,38.86 24.36,39.65 22.48,39.65 | R2.A 68.83,29.72 R5.2 | v55.66,23.21 55.66,20.61 55.3,20.25 54.41,20.25 53.83,20.83 | R58.2 76.22,63.34 | CHRIN_STS_BRD.P$4 24.03,70.78 28.25,70.78 U$9.P$3 | SUPPLY.1 86.36,28.22 85.25,27.11 82.77,27.11 81.9,27.99 U$1.8 | BYPASS-JP.2 21.67,47.42 21.67,40.46 22.48,39.65 | 22.48,39.65 21.78,38.94 C5.1
AMS_ERR  (via drill 0.35)
  Top 0.406: U$5.G 46.33,22.21 47.18,23.06 47.18,25.81 49.04,27.68 50.05,27.68 R24.1 50.47,27.69 50.93,27.23 v50.93,25.43
  Bottom 0.406: CHR_HDP_1.P$6 61.67,6.91 56.55,12.03 56.55,24.71 55.86,25.4 50.95,25.4 v50.93,25.43
AMS_ERR_INV
  Top 0.406: 42.58,20.23 42.53,20.28 U$5.5 | U$5.2 44.65,20.88 U$5.1 44.15,20.58 U$5.D | U$5.D 43.34,20.23 42.58,20.23 | R11.1 50.05,19.1 R13.2 45.22,19.05 U$5.D | AMS.C 43.03,31.24 45.72,31.24 46.99,29.97 46.99,26.67 43.69,23.37 U$5.D | U$5.6 42.58,20.23
AMS_LED_NEG
  Top 0.406: CHR_HDSCS.P$8 20.79,6.65 20.82,6.68 24.21,6.68 31.75,14.22 49.53,14.22 52,16.7 R13.1
CH_EN
  Bottom 0.406: CHR_HDP_1.P$3 75.69,17.02 90.42,17.02 91.69,18.29 105.92,18.29 106.93,19.3 106.93,29.19 102.81,33.31 102.81,45.7 107.06,49.94 107.06,66.42 100.92,72.56 CHRIN_STS_BRD1.P$2
CH_HV_IL  (via drill 0.35)
  Top 0.406: R29.1 30.21,28.45 v30.99,28.45
  Bottom 0.406: U$8.5 35.09,27.07 U$8.6 34.79,26.37 U$8.D | U$8.D 35.29,25.41 U$8.1 35.09,24.75 U$8.2 34.29,20.05 R12.2 33.54,17.03 33.53,17.02 34.54,16 CH-HV-IL.TP 35.23,16.43 38.37,16.43 39.48,15.33 39.48,5.58 40.93,4.13 73.93,4.13 74.58,4.78 CHR_HDP_1.P$10 | v30.99,28.45 34.29,28.45 34.8,27.94 U$8.D
CH_SDC_RESET
  Top 0.406: R19.2 52.52,62.73 54.18,61.08 7555.4
  Bottom 0.406: 7555.4 54.18,61.1 51.96,63.32 44.66,63.32 42.07,65.9 42.07,74.68 JP3.2
CHGR_ERR
  Top 0.406: JP2.1 35.81,43.18 CHGR-ERR.TP 37.08,48.51 37.08,70.03 38.18,71.12 40.02,71.12 CHGR_ERR.A 53.73,57.42 7555.3
CHGR_ERR_O
  Top 0.406: U$3.G 34.16,53.45 R1.1 35.05,53.07 36.07,52.05 36.07,50.04 33.53,47.5 JP2.2
CHR_LED_POS
  Top 0.406: CHR_HDSCS.P$1 2.79,16.07 2.79,46.66 5.08,48.95 14.58,48.95 16.96,51.32 16.96,66.91 20.45,70.41 CHRIN_STS_BRD.P$3
CON_SRC_IL  (via drill 0.35)
  Top 0.406: CON-SRC-IL.TP 27.43,15.75 29.21,15.75 30.99,17.53 30.99,21.84 29.97,22.86 R27.1 29.79,22.86 34.54,27.62 34.54,30.48 34.14,30.89 v31.32,30.89 | U$4.3 58.8,52.96 50.04,44.2 44.57,44.2 43.43,45.33 2V1.3 43.43,44.93 38.1,39.59 33.5,39.59 JP4.1 | v35.81,12.45 40.64,12.45 41.66,13.46 51.05,13.46 53.34,15.75 v58.93,15.75
  Bottom 0.406: R21.2 29.19,17.51 CON-SRC-IL.TP 33.02,15.24 v35.81,12.45 | CHR_HDP_1.P$8 68.58,7.37 67.56,8.38 64.77,8.38 64.26,8.89 64.26,10.67 75.31,21.72 | v31.32,30.89 28.96,33.25 JP4.1 | v58.93,15.75 61.72,15.75 68.49,22.51 74.52,22.51 75.31,21.72 | U$1.3 79.36,23.73 79.06,24.03 77.42,24.03 77.1,23.72 77.1,22.54 76.32,21.76 75.35,21.76 75.31,21.72
CON_SRC_IL_BF  (via drill 0.35)
  Top 0.406: v44.93,25.7 44.96,25.73 R16.2 | v40.16,20.39 40.24,20.31 R3.2
  Bottom 0.406: v40.16,20.39 36.85,20.39 36.28,20.96 36.28,24.67 37.31,25.7 v44.93,25.7 44.89,25.74 44.89,32.24 46.46,33.82 56.43,33.82 57.66,32.59 57.66,23.37 59.18,21.84 65.86,21.84 68.18,24.17 68.18,24.23 68.96,25 79.8,25 80.63,24.17 U$1.2 U$1.1
CON_SRC_IL_IN
  Top 0.406: R9.2 40.4,53.59 45.97,48.02 2V1.2
D+_TEENSY
  Top 0.406: CHR_HDP_2.P$5 50.04,8.68 50.04,10.67 50.8,11.43 53.85,11.43 55.22,12.8 82.26,12.8 89.92,20.46 89.92,26.41 94.49,30.98 94.49,40.64 96.32,42.48 J2.3
D-_TEENSY
  Top 0.406: J2.2 96.96,41.83 95.25,40.11 95.25,30.74 90.68,26.16 90.68,20.32 82.55,12.19 55.63,12.19 54.1,10.67 52.02,10.67 CHR_HDP_2.P$3
D_CAN_H
  Bottom 0.406: CHR_HDP_1.P$5 74.58,11.43 78.64,15.49 91.19,15.49 92.46,16.76 106.68,16.76 108.46,18.54 108.46,30.82 105.15,34.13 105.07,34.13 104.68,34.52 104.68,44.59 108.46,48.38 108.46,76.68 106.29,78.85 101.32,78.85 100.32,77.85 CHRIN_STS_BRD1.P$4
D_CAN_L
  Bottom 0.406: CHR_HDP_1.P$4 71.58,11.18 76.66,16.26 90.68,16.26 91.95,17.53 106.43,17.53 107.7,18.8 107.7,30.01 103.89,33.81 103.89,45.34 107.7,49.16 107.7,73.14 105.29,75.56 CHRIN_STS_BRD1.P$3
ERR_RST_BTN  (via drill 0.35)
  Top 0.406: JP1.1 101.35,55.41 100.62,56.13 96.3,56.13 95.5,56.93 R61.2 | 77.98,49.73 79.15,48.56 89.75,48.56 90.17,48.14 IC2.2 | D8.C 64.5,45.72 68.33,45.72 71.32,48.71 76.96,48.71 77.98,49.73 | 77.98,49.73 D7.A | CHR_HDSCS.P$6 12.22,4.04 v12.7,3.56 | v107.95,12.19 107.95,24.49 98.53,33.91 v98.53,37.6
  Bottom 0.406: JP1.1 94.49,47.24 | 94.49,47.24 IC2.2 | v12.7,3.56 13.72,2.54 98.3,2.54 v107.95,12.19 | v98.53,37.6 98.53,43.2 94.49,47.24
ERR_RST_BTN_2
  Bottom 0.406: JP1.3 91.95,49.78 IC2.3
ERR_RST_BTN_DELAY
  Top 0.406: U$4.7 70.74,54.23 71.88,55.37 71.88,58.8 72.77,59.69 79.62,59.69 80.57,58.75 80.57,56.99 81.42,56.13 84.84,56.13 86.56,54.41 86.56,53.14 88.65,51.05 91.19,51.05 91.95,50.29 91.95,45.47 91.19,44.7 IC2.1
ERR_RST_INIT
  Top 0.406: RESET_TEST.1 95.25,64.77 91.69,61.21 83.82,61.21 IC2.8 IC2.4
ERR_RST_SIDE
  Bottom 0.406: JP1.2 98.81,55.64 98.32,56.13 94.74,56.13 94.23,55.63 94.23,54.36 93.17,53.29 88.89,53.29 84.78,57.4 IC2.9
ERROR_SIG
  Top 0.406: 555.3 12.97,37.59 12.45,37.07 12.45,29.97 13.21,29.21 18.05,29.21 R30.1 20.82,31.98 24.1,31.98 24.12,32 32.77,32 JP5.2
  Bottom 0.406: 555.3 17.78,41.4 ERROR-SIG.TP
ERROR_SIG_JP  (via drill 0.35)
  Top 0.406: JP5.1 35.31,37.08 37.08,37.08 37.85,36.32 37.85,28.7 32.51,23.37 v32.51,21.84
  Bottom 0.406: R26.1 33.01,24.65 U$8.G 33.27,24.39 33.27,24.11 32.51,23.35 v32.51,21.84
FALLING_EDGE
  Top 0.406: IC2.6 90.17,57.91 94.74,62.48 98.04,62.48 99.06,63.5 RESET_TEST.2
  Bottom 0.406: U$2.1 73.03,53.39 73.59,52.83 77.47,52.83 78.74,54.1 78.74,56.39 81.13,58.77 88.8,58.77 IC2.6
GND  (via drill 0.35)
  Top 0.406: TS_TRIG.C ERROR_SIG.C | U$5.S 41.79,22.21 41.4,22.6 AMS1.C | R60.2 R31.1
  Bottom 0.406: C3.- 22.1,59.18 R25.1 25.67,54.66 C15.2 | C11.2 C13.2 51.32,54.82 49.42,52.92 C1.1 | C2.2 C6.2 11.36,35.75 9.41,33.8 R22.1 9.41,32.75 10.41,31.75 13.21,31.75 555.1 | CPC1002.2 19.3,10.74 CHR_HDSCS.P$4 | U$7.S 42.29,19.24 43.06,18.48 43.81,18.48 v43.81,18.46 | U$1.4 78.09,20.26 79.03,19.31 89.81,19.31 91.19,20.69 C7.-
  pour Top (isolate 0.254): 0.65,11.14 0.65,3.04 2.65,1.04 106.85,1.04 109.35,3.54 109.35,77.94 107.65,79.64 3.55,79.64 0.65,76.74
  pour Bottom (isolate 0.254): 5.45,0.64 7.25,0.64 103.95,0.64 109.05,5.74 109.05,76.94 106.15,79.84 4.65,79.84 1.15,76.34 1.15,4.94
GND_TEENSY  (via drill 0.35)
  Top 0.406: J2.8 107.8,41.35 J2.10 | J2.10 J2.11 | J2.11 107.64,44.8 J2.9 106.19,44.38 J2.5 106.12,43.78 106.09,43.8 95.44,43.8 93.02,41.38 93.02,31.39 88.34,26.71 88.34,21 81.36,14.02 54.5,14.02 53.3,12.82 v52.66,12.82 | J2.7 J2.11 | J2.10 J2.6
  Bottom 0.406: J2.7 J2.6 | CHR_HDP_2.P$2 48.26,12.15 48.91,12.81 v52.66,12.81 v52.66,12.82
GNDX
  Top 0.61: GNDX.2 101.9,18.8 105.16,18.8 106.68,17.27 106.68,8.64 102.36,4.32 81.09,4.32 78.81,2.03 6.35,2.03 1.78,6.6 1.78,57.73 2.79,58.74 7.61,58.74 GNDX1.1 GNDX1.2
  Bottom 0.61: GNDX.2 GNDX.1
HV_RESET
  Top 0.406: R20.1 13.97,41.64 555.4 14.99,40.13 HV-RESET.TP
  Bottom 0.406: CHR_HDSCS.P$5 7.06,6.65 3.56,10.16 3.56,28.96 4.83,30.23 14.48,30.23 17.78,33.53 HV-RESET.TP
ID_TEENSY
  Top 0.406: CHR_HDP_2.P$4 46.74,8.38 46.74,10.16 48.77,12.19 53.59,12.19 54.83,13.43 82.02,13.43 89.15,20.56 89.15,26.54 93.73,31.11 93.73,40.89 95.96,43.13 J2.4
IMD_ERR
  Bottom 0.406: U$7.G 48.9,20.21 R23.1 50.05,17.51 61.98,5.59 70.26,5.59 CHR_HDP_1.P$9
IMD_ERR_INV  (via drill 0.35)
  Top 0.406: IMD.C 48.77,32.77 v50.04,31.5
  Bottom 0.406: U$7.5 42.53,22.14 U$7.6 43.23,21.84 U$7.D 44.19,22.34 U$7.1 44.85,22.14 U$7.2 50.55,21.34 51.83,22.62 R10.1 50.1,24.84 R17.2 50.04,27.75 v50.04,31.5
IMD_GND1
  Bottom 0.406: CHR_HDP_1.P$2 73.45,17.78 90.17,17.78 91.44,19.05 105.66,19.05 106.17,19.56 106.17,28.17 101.91,32.43 101.91,45.81 106.17,50.07 106.17,65.53 102.53,69.18 97.99,69.18 97.04,70.13 97.04,73.41 97.74,74.11 102.82,74.11 103.32,73.62 CHRIN_STS_BRD1.P$1
IMD_LED_NEG  (via drill 0.35)
  Top 0.406: CHR_HDSCS.P$7 16.69,8.13 24.18,8.13 36.91,20.86 v36.91,22.11
  Bottom 0.406: v36.91,22.11 38.6,22.11 40.88,24.38 46.99,24.38 48.01,25.4 48.01,31.43 48.82,32.24 51.1,32.24 52,31.34 R17.1
LV_SUPPLY
  Bottom 0.61: LV_SUPPLY_IN.1 32,9.57 31.22,8.78 25.09,8.78 24.28,7.97 24.28,5.52 23.08,4.32 4.83,4.32 2,7.15 2,69.14 3.37,70.52 7.31,70.52 8.29,69.54 CH-1.1
LV_SUPPLY_OUT  (via drill 0.35)
  Top 0.61: FUSE_1.5A.P$1 80.01,16.69 v80.01,14.73
  Bottom 0.406: 32,5.33 LV_SUPPLY_IN.2
  Bottom 0.61: 32,5.33 34.09,3.25 84.33,3.25 85.4,4.31 85.4,10.93 ACC_LV_SUPPLY.1 87.38,13.46 86.11,14.73 v80.01,14.73
N$1
  Top 0.406: 7555.2 49.86,50.57 46.7,50.57 R9.1
  Bottom 0.406: C1.2 54.11,54.88 7555.2
N$3
  Bottom 0.406: C2.1 8.96,40.13 555.5
N$4
  Top 0.406: CHGR_ERR.C 39.47,67.75 42.15,65.08 R18.2
N$7
  Bottom 0.406: C6.1 6.6,37.34 555.6 555.7
N$9
  Bottom 0.406: R21.1 24.96,17.07 CPC1002.1
N$10
  Top 0.406: CON_SRC_IL.A 26.69,22.23 R27.2
N$11
  Top 0.406: R29.2 26.43,27.8 CH_HV_IL.A
N$13
  Top 0.406: R30.2 21.07,27.09 ERROR_SIG.A
N$14
  Top 0.406: TS_TRIG.A 21.49,19.73 R34.2
N$16
  Bottom 0.406: C11.1 49.16,59.96 7555.5
N$18
  Bottom 0.406: C13.1 47.57,56.41 7555.6 7555.7
N$21
  Top 0.406: 88.9,29.21 SUPPLY.2
  Top 0.61: SI4425.3 SI4425.2 SI4425.1 79.18,26.9 86.59,26.9 88.9,29.21
N$23
  Top 0.406: 82.98,19.15 FUSE_1.5A.P$2
  Top 0.61: SI4425.8 SI4425.7 SI4425.6 SI4425.5 82.98,19.15
N$24
  Top 0.406: R44.2 POWER.A
N$26
  Top 0.406: 2V5_REF.A 73.51,35.81 76.72,35.81 R45.2
N$35
  Top 0.406: AMS.A 44.49,35.71 R14.1
N$37
  Top 0.406: IMD.A 48.99,35.49 R15.1
N$38
  Bottom 0.406: C26.1 59.99,49.04 R33.1 69.8,49.04 C4.1 71.19,49.09 72.9,50.8 74.66,50.8 R28.1 76.2,49.26 76.2,46.23 75.44,45.47 D2.A
N$40
  Bottom 0.406: U$2.3 70.48,56.77 69.83,57.42 R32.2
N$41
  Bottom 0.406: U$2.2 71.76,52.96 71.37,52.58 66.55,52.58 65.02,51.05 R33.2
N$42
  Top 0.406: D8.A 68.85,49.53 74.31,49.53 75.17,50.39 R39.2
N$43
  Top 0.406: D7.C 75.91,54.63 R46.2
N$44
  Top 0.406: U$4.6 71.52,52.96 R39.1 R46.1 73.17,56.08 C16.1
N$45
  Bottom 0.406: U$2.6 70.48,60.12 69.55,59.18 67.31,59.18 65.28,61.21 62.23,61.21 60.44,59.42 R47.1
N$46
  Bottom 0.406: R54.1 C17.1 65.29,71.58 R48.1 61.49,66.8 D9.A
N$47
  Bottom 0.406: R48.2 69.22,64.88 U$2.5
N$48
  Bottom 0.406: R56.1 R54.2
N$49
  Bottom 0.406: U$2.8 73.03,60.07 74.02,59.08 77.37,59.08 78.22,59.93 R58.1
N$50
  Top 0.406: R57.1 65.52,56.4 66.55,55.37 69.04,55.37 U$4.8
N$51
  Top 0.406: R59.1 IC2.14
N$56
  Top 0.406: R16.1 44.92,29.36 AMS1.A
RISING_EDGE
  Top 0.406: IC2.5 93.98,58.67 93.98,60.71 95,61.72 100.08,61.72 101.6,63.25 RESET_TEST.3
  Bottom 0.406: U$2.7 71.76,58.99 72.91,57.84 78.92,57.84 79.76,58.67 79.76,61.72 80.72,62.68 91.49,62.68 92.96,61.21 92.96,55.63 92.2,54.86 IC2.5
SDC_COMP_POS
  Top 0.406: CHR_HDSCS.P$3 15.22,11.84 16.82,13.45 28.17,13.45 34.05,19.33 34.05,22.61 34.61,23.16 37.94,23.16 38.38,22.72 38.38,17.25 38.99,16.64 R3.1
SDC_KILL
  Top 0.406: 2V1.1 48.51,47.63 50.42,49.53 54.1,49.53 58.17,53.59 58.17,54.86 58.8,55.5 U$4.1
SHUTDOWN_FL
  Top 0.61: SDC-1.1 94.19,5.08 80.73,5.08 78.44,2.79 11.94,2.79 10.67,4.06 10.67,18.08 SDC-2.2
  Bottom 0.61: SDC-1.2 SDC-1.1
SHUTDOWN_INTERLOCK_IN  (via drill 0.35)
  Top 0.61: v15.54,63.13 15.54,75.73 17.53,77.72 49.47,77.72 50.21,76.99 SDC-3.1
  Bottom 0.61: SDC-2.1 15.49,24.43 15.49,29.72 20.32,34.54 20.32,44.7 18.29,46.74 18.29,57.15 15.54,59.89 v15.54,63.13
SP_RESET
  Top 0.406: R62.1 62.23,24.38 | 62.23,24.38 66.54,24.38 U$11.D | U$11.2 67.11,22.55 U$11.1 67.53,23.35 68.03,22.85 U$11.D | U$11.5 69.03,22.55 U$11.6 68.57,23.35 U$11.D | SP_RESET.TP 68.07,19.3 U$11.D | SP_RESET2.TP 56.13,39.88 56.13,29.46 58.93,26.67 60.96,26.67 62.23,25.4 62.23,24.38
  Bottom 0.406: SP_RESET.TP 60.71,11.94 60.71,8.89 61.21,8.38 63.5,8.38 64.98,6.91 CHR_HDP_1.P$7 | SP_RESET2.TP 54.1,41.96 56.13,43.99 56.13,62.62 51.05,67.7 49.14,67.7 47.79,69.05 47.79,74.67 46.7,75.77 JP3.1
SP_RESET_INV  (via drill 0.35)
  Top 0.406: R63.1 65.01,19.56 U$11.G 66.41,21.22 v64.26,23.37
  Bottom 0.406: IC2.10 80.81,54.86 77.72,51.77 77.72,44.45 77.22,43.94 73.15,43.94 71.88,42.67 71.88,36.32 71.12,35.56 64.95,35.56 63.75,34.36 63.75,23.86 64.25,23.37 v64.26,23.37
TO_GREEN_TSAL
  Top 0.406: CHR_HDSCS.P$2 13.72,8.15 13.72,5.59 15.49,3.81 56.13,3.81 57.66,5.33 57.66,7.37 60.2,9.91 CHR_HDP_1.P$1
TO_RELAY
  Top 0.406: U$3.5 27.49,52.12 U$3.6 27.95,51.32 U$3.D | U$3.D 28.95,52.32 U$3.2 29.41,52.12 U$3.1 | U$3.D 28.45,54.13 U$9.P$1
  Bottom 0.406: D3.C 35.2,57.28 U$9.P$1 29.69,59.18 R25.2 27.67,54.66 C15.1
TO_SHUTDOWN
  Top 0.406: R49.2 | R49.2 18.54,56.66 C3.+ 18.54,61.72 20.32,63.5 25.01,63.5 31.6,70.09 U$9.P$4 31.6,75.18 | BYPASS-JP.1 19.82,51.81 R49.2
  Top 0.61: SDC-3.2 50.21,72.12 49.29,73.04 33.74,73.04 31.6,75.18
  Bottom 0.406: BYPASS-JP.1 21.08,57.66 C3.+
TS_TRIG
  Top 0.406: R34.1 17.37,19.3 TS-TRIG.TP
  Bottom 0.406: TS-TRIG.TP 15.83,19.6 CPC1002.3 19.3,24.13 20.57,25.4 22.61,25.4 23.88,26.67 JP4.3
TS_TRIG1
  Top 0.406: JP4.2 26.42,33.05 25.98,32.61 16.41,32.61 555.2
  Bottom 0.406: R22.2 12.94,35.05 555.2
VBUS_TEENSY
  Top 0.406: CHR_HDP_2.P$6 55.78,11.43 83.06,11.43 91.44,19.81 91.44,26.02 96.01,30.59 96.01,39.62 97.56,41.18 J2.1
VREF-2V5
  Top 0.406: R45.1 75.69,38.85 2V5.2
VREF-2V5-BF
  Bottom 0.406: 2V5.1 73.15,41.91 74.42,43.18 80.02,43.18 81.06,42.14 81.06,34.03 79.4,32.37 79.4,29.66 | U$1.7 79.4,29.66 | 79.4,29.66 U$1.6
VREF-2V5-IN
  Bottom 0.406: 2V5.3 78.23,38.35 77.72,37.85 75.2,37.85 R6.2 71.64,33.78 R5.1 75.17,27.3 75.61,26.85 77.63,26.85 78.09,27.31 U$1.5
VREF_8.5V
  Top 0.406: R2.S 58.17,37.85 58.17,49.02 59.44,50.29 63.5,50.29 64.01,50.8 64.01,53.53 63.31,54.23 U$4.2

### Text on the board
tPlace: 100k | 10k | ERROR_RESET_BLOCK | 0E | 10k | 1k | 1uF | 22uF | 18K | REALY_BLOCK | 1k | 10k | 1k | CHAR_ERR_BLOCK | 1k | 33K | 0E | 10k | POWER_BLOCK | 10k | 10k | 10k | HV_RESET_BLOCK | 10k | 10k | 10k | 10k | 10k | 1k | 10k | 10k | 100k | 100E | 10k | LED_BLOCK
bPlace: 220K | 10uF | 1M | 0E | 0.01uF | 10K | 0E | 0E | 0.1uF | 0E | 10uF | 1uF | 0E | 1M | 1uF | DESIGNED BY- / RUCHI / VISHNU | 100nF | 100nF | 10K | 10K | HV_RESET_BLOCK | 10nF | 2K9 | 10K | 10K | 10K | 5K | 10K | 10K
tNames: CHARGER BOARD | D_CAN_H | D_CAN_L | GND | SHUTDOWN_INTERLOCK_IN | SP_RESET | CH_SDC_RESET | CH_EN | TO_SHUTDOWN | 12V | chr_led_pos | 12V | IMD_GND1 | RISING_EDGE | LV_Supply | 100uF | ERR_RST_INIT | FALLING_EDGE | ERR_RST_SIDE | ERR_RST_BTN | TO_SHUTDOWN | ERR_RST_BTN_2 | SDC_KILL | 12V | CON_SRC_IL | CON_SRC_IL_IN | CHGR_ERR_O | CHGR_ERR | VREF_2V5-BF | VREF_2V5-IN | VREF_2V5 | 6V_REF | TS_TRIG | TS_TRIG1 | CON_SRC_IL | ERROR_SIG | ERROR_SIG_UP | 12V | SDC_COMPLETE | SHUTDOWN_INTERLOCK_IN | SHUTDOWN_FL | LV_SUPPLY | GND_TEENSY | D-_TEENSY | TO_GREEN_TSAL | GND | D_CAN_L | CHR_LED_POS | TO_GREEN_TSAL | SDC_COMP_POS | GND | CH_EN | D_CAN_H | LV_SUPPLY_OUT | SHUTDOWN_FL | LV_SUPPLY_OUT | AMS_ERR | IMD_ERR | HV_RESET | ID_TEENSY | D+_TEENSY | SP_RESET | CON_SRC_IL | CH_HV_IL | ERR_RST_BTN | AMS_LED_NEG | IMD_LED_NEG | VBUS_TEENSY
tValues: 1OK | 10K